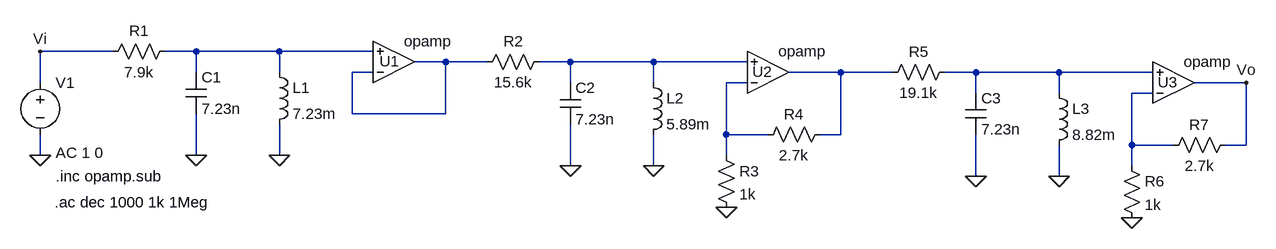
[diagram p0: schematic Circuito1.asc]
Circuito1.asc, the LTspice schematic file:
Version 4
SHEET 1 1728 680
WIRE -48 80 -160 80
WIRE 80 80 32 80
WIRE 208 80 80 80
WIRE 352 80 208 80
WIRE 464 96 416 96
WIRE 528 96 464 96
WIRE 656 96 608 96
WIRE 784 96 656 96
WIRE 928 96 784 96
WIRE 80 112 80 80
WIRE 208 112 208 80
WIRE 352 112 320 112
WIRE 1072 112 992 112
WIRE 1152 112 1072 112
WIRE 1280 112 1232 112
WIRE 1408 112 1280 112
WIRE 1552 112 1408 112
WIRE -160 128 -160 80
WIRE 656 128 656 96
WIRE 784 128 784 96
WIRE 928 128 896 128
WIRE 1696 128 1616 128
WIRE 1280 144 1280 112
WIRE 1408 144 1408 112
WIRE 1552 144 1520 144
WIRE 320 176 320 112
WIRE 464 176 464 96
WIRE 464 176 320 176
WIRE 896 208 896 128
WIRE 960 208 896 208
WIRE 1072 208 1072 112
WIRE 1072 208 1040 208
WIRE 1520 224 1520 144
WIRE 1584 224 1520 224
WIRE 1696 224 1696 128
WIRE 1696 224 1664 224
WIRE -160 240 -160 208
WIRE 80 240 80 176
WIRE 208 240 208 192
WIRE 896 240 896 208
WIRE 656 256 656 192
WIRE 784 256 784 208
WIRE 1520 256 1520 224
WIRE 1280 272 1280 208
WIRE 1408 272 1408 224
FLAG 80 240 0
FLAG 208 240 0
FLAG 656 256 0
FLAG 784 256 0
FLAG 896 320 0
FLAG 1280 272 0
FLAG 1408 272 0
FLAG 1520 336 0
FLAG 1696 128 Vo
FLAG -160 240 0
FLAG -160 80 Vi
SYMBOL cap 64 112 R0
SYMATTR InstName C1
SYMATTR Value 7.23n
SYMBOL res 48 64 R90
WINDOW 0 0 56 VBottom 2
WINDOW 3 32 56 VTop 2
SYMATTR InstName R1
SYMATTR Value 7.9k
SYMBOL ind 192 96 R0
SYMATTR InstName L1
SYMATTR Value 7.23m
SYMBOL OpAmps\\opamp 384 160 M180
WINDOW 0 -22 65 Left 2
SYMATTR InstName U1
SYMBOL cap 640 128 R0
SYMATTR InstName C2
SYMATTR Value 7.23n
SYMBOL res 624 80 R90
WINDOW 0 0 56 VBottom 2
WINDOW 3 32 56 VTop 2
SYMATTR InstName R2
SYMATTR Value 15.6k
SYMBOL ind 768 112 R0
SYMATTR InstName L2
SYMATTR Value 5.89m
SYMBOL OpAmps\\opamp 960 176 M180
WINDOW 0 -24 65 Left 2
SYMATTR InstName U2
SYMBOL res 880 224 R0
SYMATTR InstName R3
SYMATTR Value 1k
SYMBOL res 1056 192 R90
WINDOW 0 0 56 VBottom 2
WINDOW 3 32 56 VTop 2
SYMATTR InstName R4
SYMATTR Value 2.7k
SYMBOL cap 1264 144 R0
SYMATTR InstName C3
SYMATTR Value 7.23n
SYMBOL res 1248 96 R90
WINDOW 0 0 56 VBottom 2
WINDOW 3 32 56 VTop 2
SYMATTR InstName R5
SYMATTR Value 19.1k
SYMBOL ind 1392 128 R0
SYMATTR InstName L3
SYMATTR Value 8.82m
SYMBOL OpAmps\\opamp 1584 192 M180
WINDOW 0 -24 65 Left 2
SYMATTR InstName U3
SYMBOL res 1504 240 R0
SYMATTR InstName R6
SYMATTR Value 1k
SYMBOL res 1680 208 R90
WINDOW 0 0 56 VBottom 2
WINDOW 3 32 56 VTop 2
SYMATTR InstName R7
SYMATTR Value 2.7k
SYMBOL voltage -160 112 R0
WINDOW 123 24 124 Left 2
WINDOW 39 0 0 Left 0
SYMATTR InstName V1
SYMATTR Value ""
SYMATTR Value2 AC 1 0
TEXT -136 272 Left 2 !.inc opamp.sub
TEXT -138 312 Left 2 !.ac dec 1000 1k 1Meg

The netlist it stands for:
* Circuito1.asc
C1 N001 0 7.23n
R1 N001 Vi 7.9k
L1 N001 0 7.23m
XU1 N002 N001 N002 opamp Aol=100K GBW=10Meg  ; pins invin noninvin out
C2 N003 0 7.23n
R2 N003 N002 15.6k
L2 N003 0 5.89m
XU2 N006 N003 N004 opamp Aol=100K GBW=10Meg  ; pins invin noninvin out
R3 N006 0 1k
R4 N004 N006 2.7k
C3 N005 0 7.23n
R5 N005 N004 19.1k
L3 N005 0 8.82m
XU3 N007 N005 Vo opamp Aol=100K GBW=10Meg  ; pins invin noninvin out
R6 N007 0 1k
R7 Vo N007 2.7k
V1 Vi 0 AC 1 0
.inc opamp.sub
.ac dec 1000 1k 1Meg
.backanno
.end